# Altium schematic sheet FTDI.SchDoc
size Letter; Author: FF7 HD Remastered; SheetNumber: 4; SheetTotal: 7
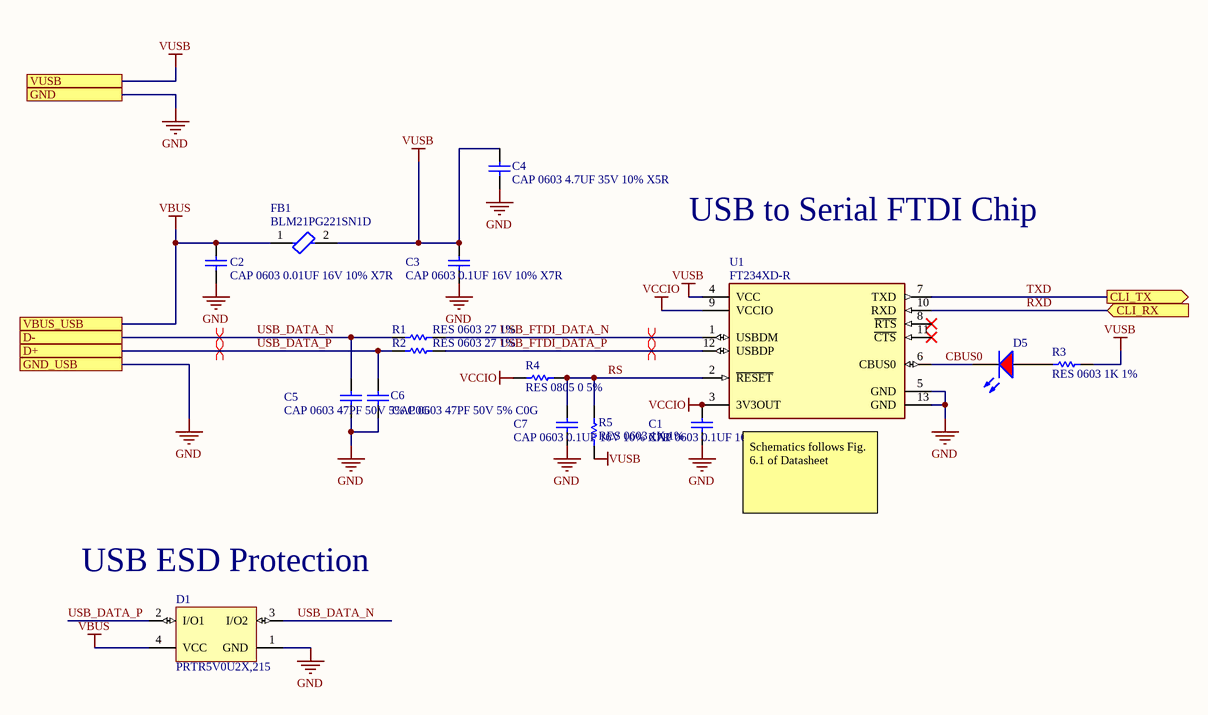
[diagram p0: FTDI.SchDoc]

## Parts
C1  CAP 0603 0.1UF 16V 10% X7R  [0603_CAP]
C2  CAP 0603 0.01UF 16V 10% X7R  [0603_CAP]
C3  CAP 0603 0.1UF 16V 10% X7R  [0603_CAP]
C4  CAP 0603 4.7UF 35V 10% X5R  [0603_CAP]
C5  CAP 0603 47PF 50V 5% C0G  [0603_CAP]
C6  CAP 0603 47PF 50V 5% C0G  [0603_CAP]
C7  CAP 0603 0.1UF 16V 10% X7R  [0603_CAP]
D1  PRTR5V0U2X,215  [NXP-SOT143B-4_V]
D5  LSM0805412V  [LED_0805_RED]  (value not drawn)
FB1  BLM21PG221SN1D  [FP-BLM21-0_2-t0_85-e0_5-IPC_B]
R1  RES 0603 27 1%  [0603_RES]
R2  RES 0603 27 1%  [0603_RES]
R3  RES 0603 1K 1%  [0603_RES]
R4  RES 0805 0 5%  [0805_RES]  (no BOM)
R5  RES 0603 1K 1%  [0603_RES]
U1  FT234XD-R  [FP-DFN-12-IPC_B]

## Ports
CLI_RX (in), CLI_TX (out), D+, D-, GND, GND_USB, VBUS_USB, VUSB

## Nets
GND: C1.1 C2.1 C3.1 C4.1 C5.1 C6.1 C7.1 D1.1(GND) U1.5(GND) U1.13(GND) ; port GND, port GND_USB
VBUS: C2.2 D1.4(VCC) FB1.1 ; port VBUS_USB
VCCIO: C1.2 R4.1 U1.3(3V3OUT) U1.9(VCCIO)
VUSB: C3.2 C4.2 FB1.2 R3.1 R5.1 U1.4(VCC) ; port VUSB
CBUS0: D5.K U1.6(CBUS0)
RS: C7.2 R4.2 R5.2 U1.2(~{RESET})
RXD: U1.10(RXD) ; port CLI_RX
TXD: U1.7(TXD) ; port CLI_TX
USB_DATA_N: C5.2 D1.3(I/O2) R1.1 ; port D-
USB_DATA_P: C6.2 D1.2(I/O1) R2.1 ; port D+
USB_FTDI_DATA_N: R1.2 U1.1(USBDM)
USB_FTDI_DATA_P: R2.2 U1.12(USBDP)
NetD5_A: D5.A R3.2

Not connected (* = marked no-connect by the designer): U1 8(~{RTS})* 11(~{CTS})*

## Layout directives
differential pair: USB_DATA_N, USB_DATA_P, USB_FTDI_DATA_N, USB_FTDI_DATA_P

## Notes on the sheet
- USB to Serial FTDI Chip
- Schematics follows Fig. 6.1 of Datasheet
- (near D1) USB ESD Protection
- Title:
- Desc:
- Size:
- Letter
- Auth:
- Proj:
- Sheet
- of
- www.seas.upenn.edu
- Electrical and Systems Engineering

## Library data of the parts
C1 C3 C7 = CMP-011-000221-1: Capacitor Surface Mount 0603 Footprint 0.1UF 16V 10% Tolerance Ceramic X7R; Manufacturer: Various; Description in Visual: Cap SMT 0603 0.1UF 16V 10%  Cer X7R; PCB Package: 0603; Mount: SMT; Manufacturer P/N: CAP 0603 0.1UF 16V 10% X7R; Type: Ceramic X7R; Voltage: 16V; P/N: CAP 0603 0.1UF 16V 10% X7R; Value: 0.1UF; Tolerance: 10%
C2 = CMP-011-000185-1: Capacitor Surface Mount 0603 Footprint 0.01UF 16V 10% Tolerance Ceramic X7R; Manufacturer: Various; Description in Visual: Cap SMT 0603 0.01UF 16V 10%  Cer X7R; PCB Package: 0603; Type: Ceramic X7R; Manufacturer P/N: CAP 0603 0.01UF 16V 10% X7R; Value: 0.01UF; P/N: CAP 0603 0.01UF 16V 10% X7R; Voltage: 16V; Tolerance: 10%; Mount: SMT
C4 = CMP-011-000330-1: Capacitor Surface Mount 0603 Footprint 47UF 35V 10% Tolerance Ceramic X5R; Manufacturer: Various; PCB Package: 0603; P/N: CAP 0603 4.7UF 35V 10% X5R; Mount: SMT; Manufacturer P/N: CAP 0603 4.7UF 35V 10% X5R; Description in Visual: CAP 0603 4.7UF 35V 10% X5R; Type: Ceramic X5R
C5 C6 = CMP-011-000339-1: Capacitor Surface Mount 0603 Footprint 47PF 50V 5% Tolerance Ceramic C0G; Manufacturer: Various; Description in Visual: Cap SMT 0603 47PF 50V 5%  Cer C0G; PCB Package: 0603; Manufacturer P/N: CAP 0603 47PF 50V 5% C0G; Value: 47PF; Voltage: 50V; P/N: CAP 0603 47PF 50V 5% C0G; Mount: SMT; Tolerance: 5%; Type: Ceramic C0G
D1 = CMP-2000-05285-1: Ultra Low Capacitance Double Rail-to-Rail ESD Protection Diode, 5.5 V, 1 pF, -40 to 85 degC, 4-Pin SOT143B, RoHS, Tape and Reel; Manufacturer: NXP Semiconductors; Capacitance Value: 16pF; Number of Elements: 1; Rad Hardened: No; Reverse Breakdown Voltage: 6V; Working Voltage (Max): 5.5V; Polarity: Uni-Directional; Configuration: Quad; Leakage Current: 0.1uA; Product Height (mm): 1mm; Suppressor Type: DiodeArrays; Product Length (mm): 3mm; Product Depth (mm): 1.4mm; ESD Protection Voltage: 8KV@ContactDisc; Package Type: SOT; Mounting: SurfaceMount; Packaging: TapeandReel; Datasheet Version: Rev. 02, 01/2008; Reverse Stand-off Voltage: 5.5V; Manufacturer URL: http://www.nxp.com/; Operating Temp Range: -40Cto85C; Operating Temperature Classification: Industrial; Working Voltage: 5.5V; Operating Temperature Min Deg. C: -40C; Datasheet URL: https://datasheet.ciiva.com/4479/prtr5v0u2x-102853-4479461.pdf; Leakage Current (Max): 0.1uA; Direction Type: Uni-Directional; Pin Count: 3+Tab; Operating Temperature Max Deg. C: 85C; Mounting Style: SurfaceMount; Package / Case: SOT
D5 = CMP-00026-00001-1: Single Color LED, RED, 0805; Test Current: 20mA; Forward Voltage: 2V; RoHS Compliant: Yes
FB1 = CMP-0686-00610-3: Chip Ferrite Bead, 0805, 220Ω @ 100MHz, 0.045Ω, 25%, 2A; Number of Circuits: 1; Shielding: Unshielded; DC Resistance (DCR): 45mR; Impedance: 220R; Radiation Hardening: No; Material: Ferrite; Frequency: 100MHz; Width: 1.25mm; DC Current: 2A; Max DC Current: 2A; Number of Lines: 1; Package Quantity: 1; Case Code (Metric): 2012; Current Rating: 2A; Case/Package: 0805; Current: 2A; Military Standard: Not; Core Material: Ferrite; Depth: 1.25mm; Contact Plating: Tin; DC Resistance-Max: 45mR; Max Operating Temperature: 125°C; Length: 2mm; Max Current Rating: 2A; REACH SVHC: No SVHC; Termination: SMD/SMT; Min Operating Temperature: -55°C; Series: BLM21P; Test Frequency: 100MHz; Tolerance: 25%; Number of Pins: 2; RoHS Compliant: Yes; Height: 0.85mm; Packaging: Tape and Reel; Lead Free: Lead Free; Case Code (Imperial): 0805
R1 R2 = CMP-005-002764-1: Resistor Surface Mount, 27 Ohms, 0603 Footprint, 1% Tolerance 0.1W; Manufacturer P/N: RES 0603 27R 1%; Manufacturer: Various; Description in Visual: Res SMT 27 0603  1%  0.1W; Value: 27; PCB Package: 0603; Mount: SMT; Tolerance: 1%; Power Rating: 0.1W
R3 R5 = CMP-005-002503-2: Resistor Surface Mount, 1K Ohms, 0603 Footprint, 1% Tolerance 0.1W; Manufacturer: Various; PCB Package: 0603; Description in Visual: Res SMT 1K 0603  1%  0.1W; Tolerance: 1%; Value: 1k; Mount: SMT; Power Rating: 0.1W; Manufacturer P/N: RES 0603 1K 1%; JLCPCB Part #: C21190
R4 = CMP-005-003861-1: Resistor Surface Mount, 0 Ohms, 0805 Footprint, 5% Tolerance 0.125W; Manufacturer P/N: RES 0805 0R 5%; Manufacturer: Various; Description in Visual: Res SMT 0 0805  5%  0.125W; PCB Package: 0805; Value: 0; Mount: SMT; Power Rating: 0.125W; Tolerance: 5%
U1 = CMP-0248-00027-3: IC USB SERIAL BASIC UART 12DFN; Min Supply Voltage: 2.97V; Number of Ports: 1; Operating Supply Voltage: 5V; Operating Supply Current: 8mA; Max Supply Voltage: 5.5V; Data Rate: 3Mbps; Length: 3mm; Case/Package: DFN; Mount: Surface Mount; Packaging: Tape and Reel; Max Operating Temperature: 85°C; Height: 0.75mm; Number of Pins: 12; Number of Transceivers: 1; Package Quantity: 5000; Min Operating Temperature: -40°C; Width: 3mm; REACH SVHC: No SVHC; Interface: UART; Lead Free: Lead Free